# Altium schematic sheet ADC_ADS4128.SchDoc
size A3; DocumentNumber: 1; SheetNumber: 1; SheetTotal: 5
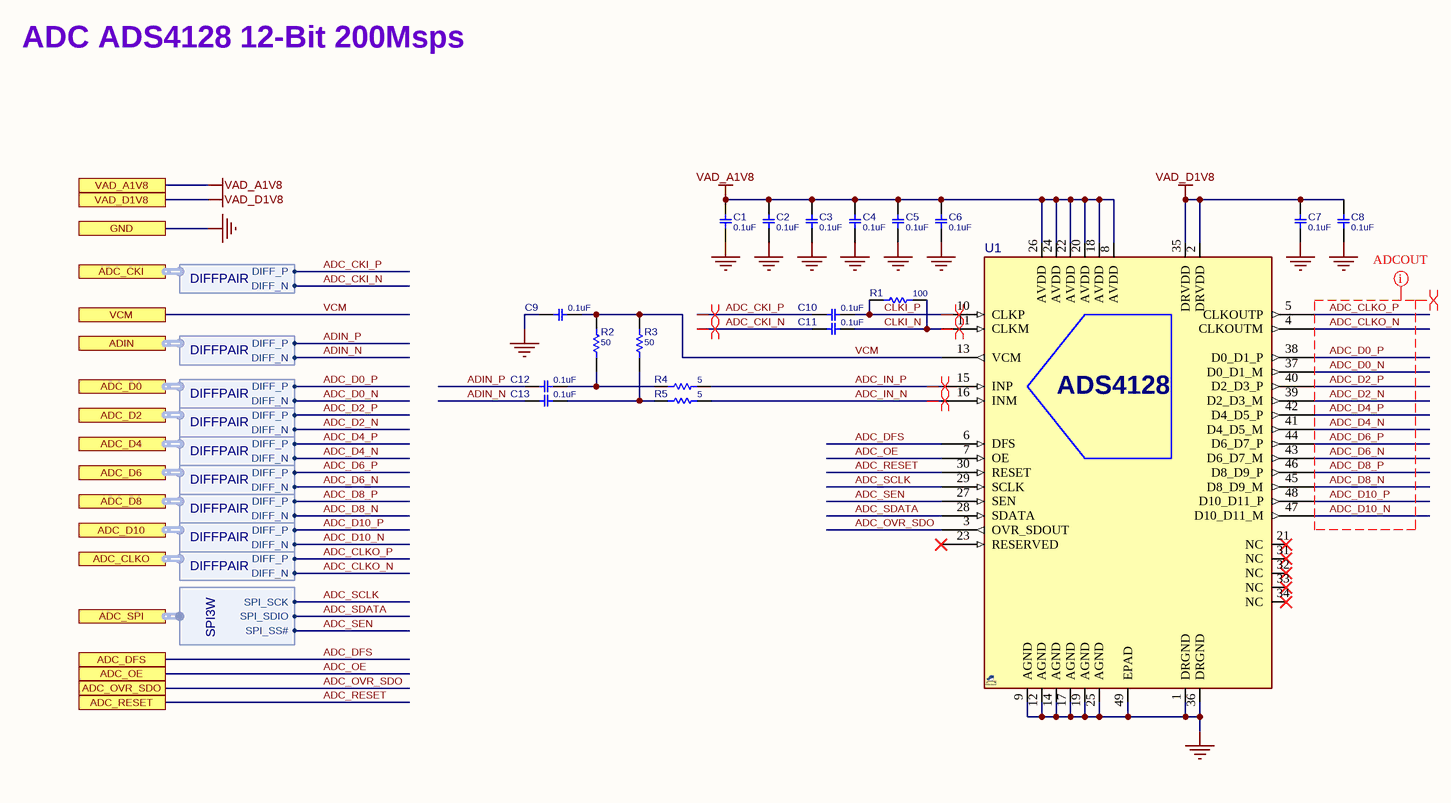
[diagram p0: ADC_ADS4128.SchDoc]

## Parts
C1  0.1uF  [C0402]
C2  0.1uF  [C0402]
C3  0.1uF  [C0402]
C4  0.1uF  [C0402]
C5  0.1uF  [C0402]
C6  0.1uF  [C0402]
C7  0.1uF  [C0402]
C8  0.1uF  [C0402]
C9  0.1uF  [C0402]
C10  0.1uF  [C0402]
C11  0.1uF  [C0402]
C12  0.1uF  [C0402]
C13  0.1uF  [C0402]
R1  100  [R0402]
R2  50  [R0402]
R3  50  [R0402]
R4  5  [R0402]
R5  5  [R0402]
U1  ADS4128  [QFN50_48T]  (value not drawn)

## Ports
ADC_CKI (harness DIFFPAIR), ADC_CLKO (harness DIFFPAIR), ADC_D0 (harness DIFFPAIR), ADC_D2 (harness DIFFPAIR), ADC_D4 (harness DIFFPAIR), ADC_D6 (harness DIFFPAIR), ADC_D8 (harness DIFFPAIR), ADC_D10 (harness DIFFPAIR), ADC_DFS, ADC_OE, ADC_OVR_SDO, ADC_RESET, ADC_SPI (harness SPI3W), ADIN (harness DIFFPAIR), GND, VAD_A1V8, VAD_D1V8, VCM

## Harnesses
DIFFPAIR: DIFF_N, DIFF_P
SPI3W: SPI_SCK, SPI_SDIO, SPI_SS#

## Nets
GND: C1.2 C2.2 C3.2 C4.2 C5.2 C6.2 C7.2 C8.2 C9.2 U1.1(DRGND) U1.9(AGND) U1.12(AGND) U1.14(AGND) U1.17(AGND) U1.19(AGND) U1.25(AGND) U1.36(DRGND) U1.49(EPAD) ; port GND
VAD_A1V8: C1.1 C2.1 C3.1 C4.1 C5.1 C6.1 U1.8(AVDD) U1.18(AVDD) U1.20(AVDD) U1.22(AVDD) U1.24(AVDD) U1.26(AVDD) ; port VAD_A1V8
VAD_D1V8: C7.1 C8.1 U1.2(DRVDD) U1.35(DRVDD) ; port VAD_D1V8
ADC_CKI_N: C11.2 ; port ADC_CKI.DIFF_N
ADC_CKI_P: C10.2 ; port ADC_CKI.DIFF_P
ADC_CLKO_N: U1.4(CLKOUTM) ; port ADC_CLKO.DIFF_N
ADC_CLKO_P: U1.5(CLKOUTP) ; port ADC_CLKO.DIFF_P
ADC_D0_N: U1.37(D0_D1_M) ; port ADC_D0.DIFF_N
ADC_D0_P: U1.38(D0_D1_P) ; port ADC_D0.DIFF_P
ADC_D2_N: U1.39(D2_D3_M) ; port ADC_D2.DIFF_N
ADC_D2_P: U1.40(D2_D3_P) ; port ADC_D2.DIFF_P
ADC_D4_N: U1.41(D4_D5_M) ; port ADC_D4.DIFF_N
ADC_D4_P: U1.42(D4_D5_P) ; port ADC_D4.DIFF_P
ADC_D6_N: U1.43(D6_D7_M) ; port ADC_D6.DIFF_N
ADC_D6_P: U1.44(D6_D7_P) ; port ADC_D6.DIFF_P
ADC_D8_N: U1.45(D8_D9_M) ; port ADC_D8.DIFF_N
ADC_D8_P: U1.46(D8_D9_P) ; port ADC_D8.DIFF_P
ADC_D10_N: U1.47(D10_D11_M) ; port ADC_D10.DIFF_N
ADC_D10_P: U1.48(D10_D11_P) ; port ADC_D10.DIFF_P
ADC_DFS: U1.6(DFS) ; port ADC_DFS
ADC_IN_N: R5.2 U1.16(INM)
ADC_IN_P: R4.2 U1.15(INP)
ADC_OE: U1.7(OE) ; port ADC_OE
ADC_OVR_SDO: U1.3(OVR_SDOUT) ; port ADC_OVR_SDO
ADC_RESET: U1.30(RESET) ; port ADC_RESET
ADC_SCLK: U1.29(SCLK) ; port ADC_SPI.SPI_SCK
ADC_SDATA: U1.28(SDATA) ; port ADC_SPI.SPI_SDIO
ADC_SEN: U1.27(SEN) ; port ADC_SPI.SPI_SS#
ADIN_N: C13.2 ; port ADIN.DIFF_N
ADIN_P: C12.2 ; port ADIN.DIFF_P
CLKI_N: C11.1 R1.2 U1.11(CLKM)
CLKI_P: C10.1 R1.1 U1.10(CLKP)
VCM: C9.1 R2.2 R3.2 U1.13(VCM) ; port VCM
NetC12_1: C12.1 R2.1 R4.1
NetC13_1: C13.1 R3.1 R5.1

Not connected (* = marked no-connect by the designer): U1 21(NC)* 23(RESERVED)* 31(NC)* 32(NC)* 33(NC)* 34(NC)*

## Layout directives
differential pair: ADC_CKI_N, ADC_CKI_P, ADC_CLKO_N, ADC_CLKO_P, ADC_D0_N, ADC_D0_P, ADC_D2_N, ADC_D2_P, ADC_D4_N, ADC_D4_P, ADC_D6_N, ADC_D6_P, ADC_D8_N, ADC_D8_P, ADC_D10_N, ADC_D10_P, ADC_IN_N, ADC_IN_P, CLKI_N, CLKI_P
net class ADCOUT: ADC_CLKO_N, ADC_CLKO_P, ADC_D0_N, ADC_D0_P, ADC_D2_N, ADC_D2_P, ADC_D4_N, ADC_D4_P, ADC_D6_N, ADC_D6_P, ADC_D8_N, ADC_D8_P, ADC_D10_N, ADC_D10_P

## Notes on the sheet
- ADC ADS4128 12-Bit 200Msps

## Library data of the parts
C1-C13 = CAP_SMD_MLCC_100n50T: CAP, MLCC; PARAM: 50V; PARAM2: X5R, 10%; MANF_P#: -; MANF: -; DESC: -; ASSEMBLY: ASSEMBLY; PRICE: 100= 5$; VALUE: 0.1uF
R1-R5 = RES_SMD_10K_0402: RESISTOR, SMD; MANF: Yageo; PARAM: 0.063W; DESC: DESCRIPTION; DIST#: MOUSER; PARAM2: 1%; ASSEMBLY: ASSEMBLY; PRICE: 100= 0.3$; MANF_P#: -
  R1: VALUE: 100
  R2 R3: VALUE: 50
  R4 R5: VALUE: 5
U1 = ADS4128_QFN48: ADC, 12-Bit, 200MSPS, Parallel LVDS, 1.8V, QFN-48; MANF_P#: ADS4128IRGZ; MANF: TI; PARAM2: 1.8V, 500mW; PARAM: 250 MSPS, 2CH, Parallel LVDS; VALUE: ADS4128; PACKAGE: QFN-48